# Altium schematic sheet Sheet1.SchDoc
size B
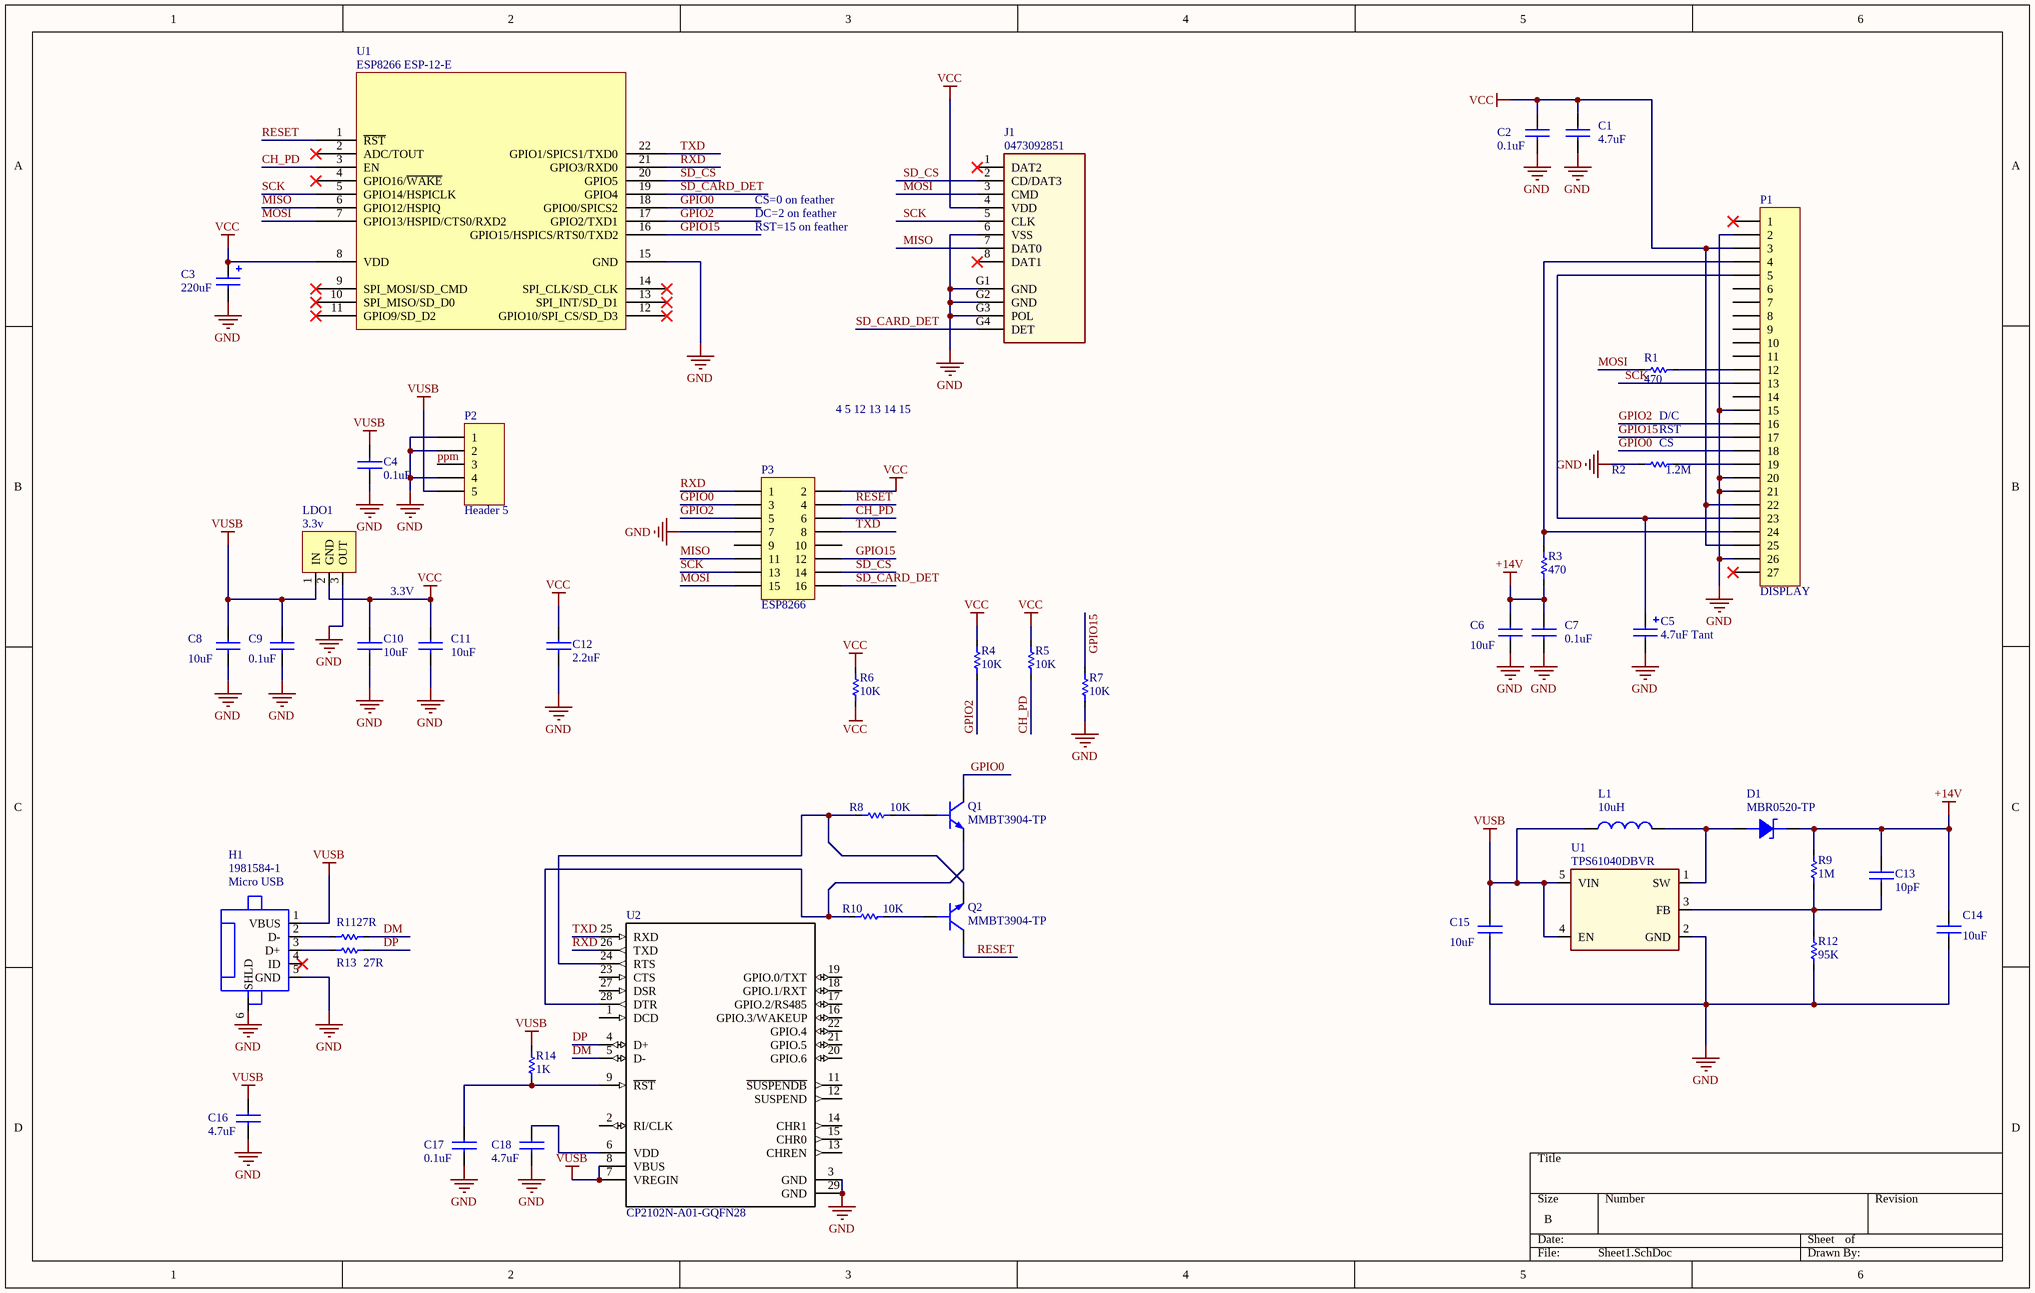
[diagram p0: Sheet1.SchDoc]

## Parts
(Parts that share a designator on the sheet are numbered #1, #2 ... from top to bottom, then left to right.)
C1  4.7uF  [1206x]
C2  0.1uF  [0603x]
C3  220uF  [CAPMP6032X260N_POL]
C4  0.1uF  [0603x]
C5  4.7uF Tant  [CAPC3216X160N_POL]
C6  10uF  [1206x]
C7  0.1uF  [0603x]
C8  10uF  [1206x]
C9  0.1uF  [0603x]
C10  10uF  [1206x]
C11  10uF  [1206x]
C12  2.2uF  [0603x]
C13  10pF  [0603x]
C14  10uF  [1206x]
C15  10uF  [1206x]
C16  4.7uF  [0603x]
C17  0.1uF  [0603x]
C18  4.7uF  [0603x]
D1  MBR0520-TP  [SOD123]
H1  Micro USB  [1981584-1]
J1  0473092851  [microSD_V1]
L1  value 10uH  [1812]  (hidden comment: LQH43CN100K03L)
LDO1  3.3v  [_PKG_SOT223]
P1  DISPLAY  [OLED_GLASS 0.96 INCH - new]
P2  Header 5  [HDR1X5]
P3  ESP8266  [HDR2X8]
Q1  MMBT3904-TP  [SOT95P240X110-3N]
Q2  MMBT3904-TP  [SOT95P240X110-3N]
R1  470  [0603x]
R2  1.2M  [0603x]
R3  470  [0603x]
R4  10K  [0603x]
R5  10K  [0603x]
R6  10K  [0603x]
R7  10K  [0603x]
R8  10K  [0603x]
R9  1M  [0603x]
R10  10K  [0603x]
R11  27R  [0603x]
R12  95K  [0603x]
R13  27R  [0603x]
R14  1K  [0603x]
U1#1  ESP8266 ESP-12-E  [ESP8266 ESP_12E]  (graphical)
U1#2  TPS61040DBVR  [SOT95P280X144-5N]
U2  CP2102N-A01-GQFN28  [*QFN50P500X500X80-29N]

## Nets
+14V: C6.1 C7.1 C13.1 C14.1 D1.1(Cathode) R3.1 R9.1
GND: C1.2 C2.2 C3.2 C4.1 C5.2 C6.2 C7.2 C8.2 C9.2 C10.2 C11.2 C12.2 C14.2 C15.2 C16.2 C17.2 C18.2 H1.5(GND) H1.6(SHLD) J1.6(VSS) J1.G1(GND) J1.G2(GND) J1.G3(POL) LDO1.3(OUT) P1.2 P1.15 P1.20 P1.21 P1.26 P2.1 P2.2 P2.4 P3.7 R2.1 R7.2 R12.2 U1#1.15(GND) U1#2.2(GND) U2.3(GND) U2.29(GND)
VCC: C1.1 C2.1 C3.1 C10.1 C11.1 C12.1 J1.4(VDD) LDO1.2(GND) P1.3 P1.22 P1.25 P3.2 R4.1 R5.1 R6.1 R6.2 U1#1.8(VDD)
VUSB: C4.2 C8.1 C9.1 C15.1 C16.1 H1.1(VBUS) L1.1 LDO1.1(IN) P2.5 R14.1 U1#2.4(EN) U1#2.5(VIN) U2.7(VREGIN) U2.8(VBUS)
CH_PD: P3.6 R5.2 U1#1.3(EN)
DM: R11.2 U2.5(D-)
DP: R13.2 U2.4(D+)
GPIO0: P1.18 P3.3 Q1.3(C) U1#1.18(GPIO0/SPICS2)
GPIO2: P1.16 P3.5 R4.2 U1#1.17(GPIO2/TXD1)
GPIO15: P1.17 P3.12 R7.1 U1#1.16(GPIO15/HSPICS/RTS0/TXD2)
MISO: J1.7(DAT0) P3.11 U1#1.6(GPIO12/HSPIQ)
MOSI: J1.3(CMD) P3.15 R1.2 U1#1.7(GPIO13/HSPID/CTS0/RXD2)
ppm: P2.3
RESET: P3.4 Q2.3(C) U1#1.1(~{RST})
RXD: P3.1 U1#1.21(GPIO3/RXD0) U2.26(TXD)
SCK: J1.5(CLK) P1.13 P3.13 U1#1.5(GPIO14/HSPICLK)
SD_CARD_DET: J1.G4(DET) P3.16 U1#1.19(GPIO4)
SD_CS: J1.2(CD/DAT3) P3.14 U1#1.20(GPIO5)
TXD: P3.8 U1#1.22(GPIO1/SPICS1/TXD0) U2.25(RXD)
NetC5_1: C5.1 P1.5 P1.23
NetC13_2: C13.2 R9.2 R12.1 U1#2.3(FB)
NetC17_1: C17.1 R14.2 U2.9(~{RST})
NetC18_1: C18.1 U2.6(VDD)
NetD1_2: D1.2(Annode) L1.2 U1#2.1(SW)
NetH1_2: H1.2(D-) R11.1
NetH1_3: H1.3(D+) R13.1
NetP1_4: P1.4 P1.24 R3.2
NetP1_12: P1.12 R1.1
NetP1_19: P1.19 R2.2
NetQ1_1: Q1.1(B) R8.2
NetQ1_2: Q1.2(E) R10.1 U2.28(DTR)
NetQ2_1: Q2.1(B) R10.2
NetQ2_2: Q2.2(E) R8.1 U2.24(RTS)

Not connected (* = marked no-connect by the designer): H1 4(ID)*; J1 1(DAT2)* 8(DAT1)*; LDO1 4(GND); P1 1* 6 7 8 9 10 11 14 27*; P3 9 10; U1#1 2(ADC/TOUT)* 4(GPIO16/~{WAKE})* 9(SPI_MOSI/SD_CMD)* 10(SPI_MISO/SD_D0)* 11(GPIO9/SD_D2)* 12(GPIO10/SPI_CS/SD_D3)* 13(SPI_INT/SD_D1)* 14(SPI_CLK/SD_CLK)*; U2 1(DCD) 2(RI/CLK) 11(~{SUSPENDB}) 12(SUSPEND) 13(CHREN) 14(CHR1) 15(CHR0) 16(GPIO.3/WAKEUP) 17(GPIO.2/RS485) 18(GPIO.1/RXT) 19(GPIO.0/TXT) 20(GPIO.6) 21(GPIO.5) 22(GPIO.4) 23(CTS) 27(DSR)

## Notes on the sheet
- RST=15 on feather
- DC=2 on feather
- CS=0 on feather
- 4 5 12 13 14 15
- (near R2) RST
- D/C
- (near R2) CS
- 3.3V

## Library data of the parts
C1 = CAP_1206: CAP CER 4.7UF 16V 10% X7R 1206; PartNumber: CL31B475KOHNFNE; Manufacturer: Samsung; Vendor: Digi-Key; Value: 4.7uF
C2 C4 C7 C9 C16-C18 = CAP_0603: CAP CER 0.1UF 16V 10% X7R 0603; PartNumber: GRM188R71C104KA01D; Manufacturer: Murata; Vendor: Digi-Key; Value: 0.1uF
C3 = CAP_TANT_6032: CAP TANT 220UF 6.3V 10% 2312; PartNumber: T495C227K006ATE225; Manufacturer: Kemet; Vendor: Digi-Key; Value: 220uF
C5 = CAP_TANT_1206: 4.7µF Molded Tantalum Capacitors; PartNumber: T491A475M025AT; Manufacturer: Kemet; Vendor: Digi-Key; Value: 4.7uF Tant
C6 C8 C10 C11 C14 C15 = CAP_1206: CAP CER 10UF 16V 10% X7R 1206; PartNumber: CL31B106KOHNNNE; Manufacturer: Samsung; Vendor: Digi-Key; Value: 10uF
C12 = CAP_0805: CAP CER 2.2UF 16V 10% X5R 0603; Manufacturer: Kemet; PartNumber: C0603C225K4PACTU; Vendor: Digi-Key; Value: 2.2uF
C13 = CAP_0603: 10pF 50V Ceramic Capacitor C0G; PartNumber: C0603C100J5GACTU; Manufacturer: Kemet; Vendor: Digi-Key; Value: 10pF
D1 = MBR0520-TP: DIODE SCHOTTKY 20V 500MA SOD123; Manufacturer: Micro; Vendor: Digikey; PartNumber: MBR0520-TP
H1 = 1981584-1: CONN RCPT MICRO USB TYPE AB; Manufacturer: TE Connectivity; Vendor: Digi-Key; PartNumber: 1981584-1; Value: Micro USB
J1 = 0473092851: 9 (8 + 1) microSD SMT, Right Angle; Manufacturer: Molex; Vendor: Digi-Key; PartNumber: 0473092851
L1 = LQH43CN100K03L: INDUCTOR 10UH 10% 650MA 1812; Manufacturer: Murata; Vendor: Digikey; PartNumber: LQH43CN100K03L
LDO1 = E-05-072: IC,REG,3.3V,LDO,SOT223,RoHS; PartNumber: MIC5209-3.3YS TR; Manufacturer: Microchip; Vendor: Digi-Key; Value: 3.3V
P1 = Header 27: Header, 25-Pin; LatestRevisionDate: 17-Jul-2002; LatestRevisionNote: Re-released for DXP Platform.; Publisher: Altium Limited
P2 = Header 5: Header, 5-Pin; LatestRevisionDate: 17-Jul-2002; LatestRevisionNote: Re-released for DXP Platform.; Publisher: Altium Limited
P3 = Header 8X2: Header, 8-Pin, Dual row; LatestRevisionDate: 17-Jul-2002; LatestRevisionNote: Re-released for DXP Platform.; Publisher: Altium Limited
Q1 Q2 = MMBT3904-TP: TRANS NPN GP 40V SOT23; Manufacturer: Micro Commercial; Vendor: Digi-Key; PartNumber: MMBT3904-TP
R1 R3-R8 R10 = RES_0603: RES SMD 10K OHM 1% 1/10W 0603; Manufacturer: Panasonic; PartNumber: ERJ-3EKF1002V; Vendor: Digi-Key
  R1 R3: Value: 470
  R4-R8 R10: Value: 10K
R2 = RES_0603: RES SMD 1.2M OHM 1% 1/10W 0603; Manufacturer: Panasonic; PartNumber: ERJ-3EKF1204V; Vendor: Digi-Key; Value: 1.2M
R9 = RES_0603: RES SMD 1M OHM 1% 1/10W 0603; Manufacturer: Panasonic; PartNumber: ERJ-3EKF1004V; Vendor: Digi-Key; Value: 1M
R11 R13 = RES_0603: RES SMD 27 OHM 1% 1/10W 0603; Manufacturer: Panasonic; PartNumber: ERJ-3EKF27R0V; Vendor: Digi-Key; Value: 27R
R12 = RES_0603: RES SMD 95.3K OHM 1% 1/10W 0603; Manufacturer: Yageo; PartNumber: RC0603FR-0795K3L; Vendor: Digi-Key; Value: 95K
R14 = RES_0603: RES SMD 1K OHM 1% 1/10W 0603; Manufacturer: Panasonic; PartNumber: ERJ-3EKF1001V; Vendor: Digi-Key; Value: 1K
U1#1 = ESP8266 ESP-12-E: Manufacturer: Espressif; PartNumber: ESP-12-E; Vendor: N/A
U1#2 = TPS61040DBVR: IC LED DRVR WHITE BCKLGT SOT23-5; Manufacturer: Texas Instruments; Vendor: Digi-key; PartNumber: TPS61040DBVR
U2 = CP2102N-A01-GQFN28: Usb-Uart Interface Bridge, Qfn-28; MF: Silicon Labs; MP: CP2102N-A01-GQFN28; SnapEDA_Link: https://www.snapeda.com/parts/CP2102N-A01-GQFN28/Silicon%20Labs/view-part/?ref=snap; Digi-Key_Purchase_URL: https://www.digikey.com/product-detail/en/silicon-labs/CP2102N-A01-GQFN28/336-3694-ND/6012519?utm_source=snapeda&utm_medium=aggregator&utm_campaign=symbol; Digi-Key_Part_Number: 336-3694-ND; Package: QFN-28 Silicon Labs; Value: *